# Altium schematic sheet lpc11c14.SchDoc
size A4; Organization: UNSW Solar Racing Team; Address3: UNSW; Address4: Sydney NSW 2052; Address2: Electrical Engineering; Address1: Rm 109
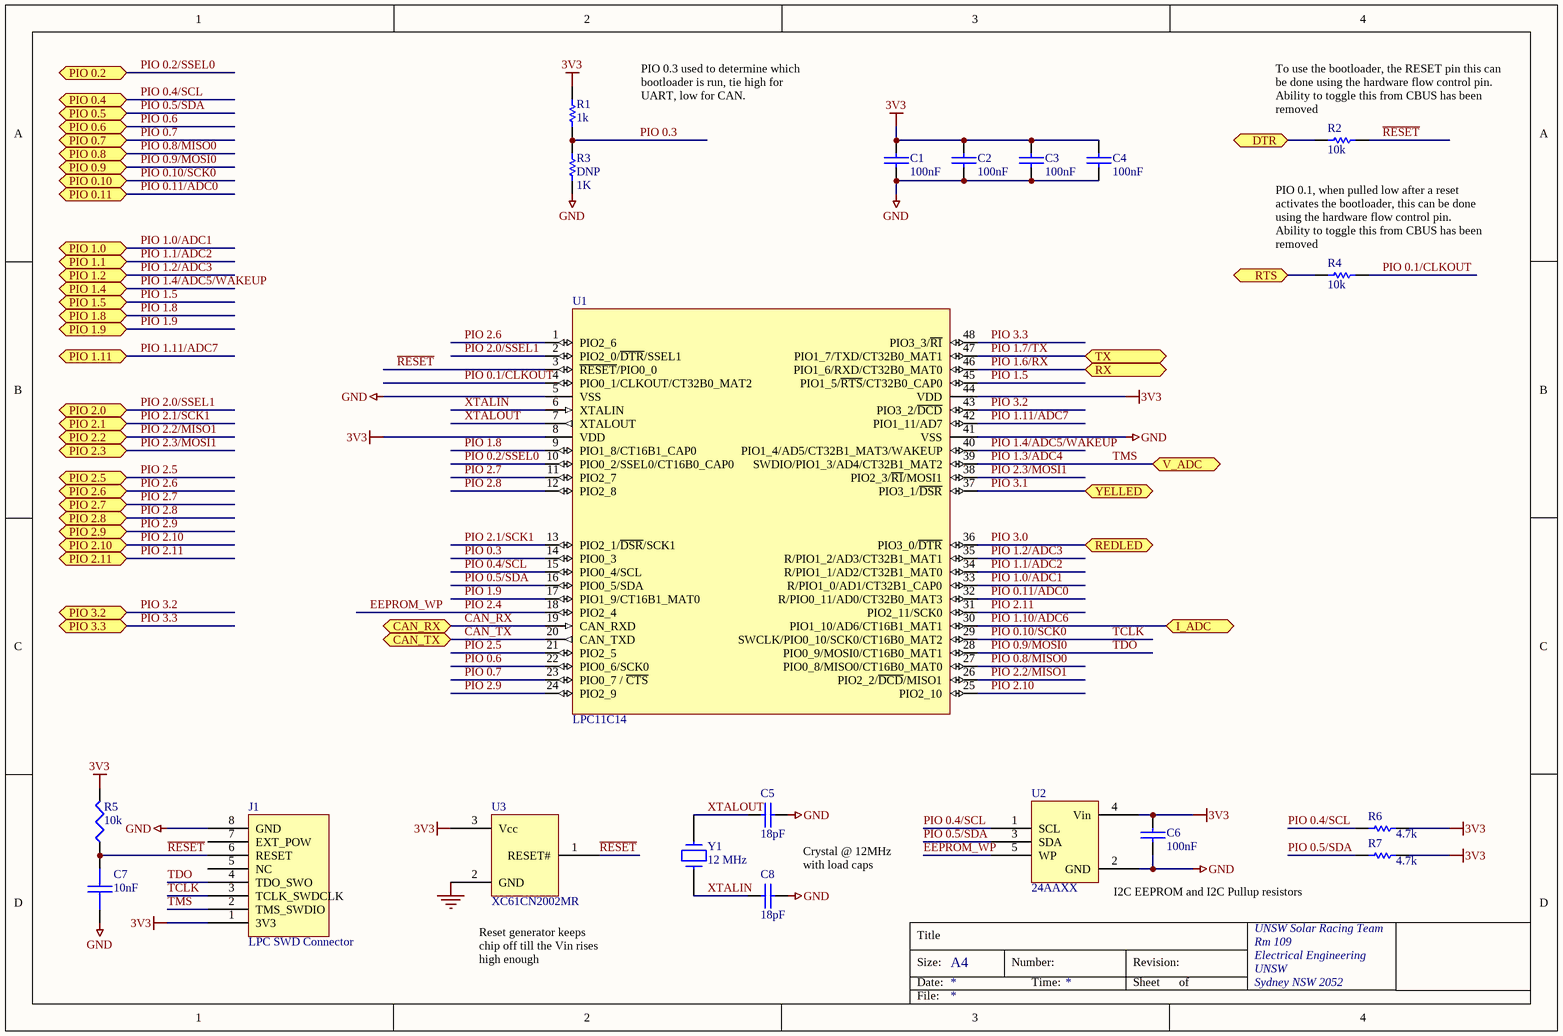
[diagram p0: lpc11c14.SchDoc]

## Parts
C1  100nF  [0603]
C2  100nF  [0603]
C3  100nF  [0603]
C4  100nF  [0603]
C5  18pF  [0603]
C6  100nF  [0603]
C7  10nF  [0603]
C8  18pF  [0603]
J1  LPC SWD Connector  [IDC8]
R1  1k  [0603]
R2  10k  [0603]
R3  DNP  value 1K  [0603]
R4  10k  [0603]
R5  10k  [0603]
R6  4.7k  [0603]
R7  4.7k  [0603]
U1  LPC11C14  [QFP48]
U2  24AAXX  [SOT23-5]
U3  XC61CN2002MR  [SOT23-3]
Y1  12 MHz  [HC49/4H]

## Ports
CAN_RX, CAN_TX, DTR, I_ADC, PIO 0.2, PIO 0.4, PIO 0.5, PIO 0.6, PIO 0.7, PIO 0.8, PIO 0.9, PIO 0.10, PIO 0.11, PIO 1.0, PIO 1.1, PIO 1.2, PIO 1.4, PIO 1.5, PIO 1.8, PIO 1.9, PIO 1.11, PIO 2.0, PIO 2.1, PIO 2.2, PIO 2.3, PIO 2.5, PIO 2.6, PIO 2.7, PIO 2.8, PIO 2.9, PIO 2.10, PIO 2.11, PIO 3.2, PIO 3.3, REDLED (bidir), RTS, RX, TX, V_ADC, YELLED (bidir)

## Nets
3V3: C1.1 C2.1 C3.1 C4.1 C6.1 J1.1(3V3) R1.2 R5.2 R6.2 R7.2 U1.8(VDD) U1.44(VDD) U2.4(Vin) U3.3(Vcc)
GND: C1.2 C2.2 C3.2 C4.2 C5.2 C6.2 C7.2 C8.2 J1.8(GND) R3.1 U1.5(VSS) U1.41(VSS) U2.2(GND) U3.2(GND)
CAN_RX: U1.19(CAN_RXD) ; port CAN_RX
CAN_TX: U1.20(CAN_TXD) ; port CAN_TX
DTR: R2.1 ; port DTR
EEPROM_WP: U1.18(PIO2_4) U2.5(WP)  [also labelled PIO 2.4]
PIO 0.1/CLKOUT: R4.2 U1.4(PIO0_1/CLKOUT/CT32B0_MAT2)
PIO 0.2/SSEL0: U1.10(PIO0_2/SSEL0/CT16B0_CAP0) ; port PIO 0.2
PIO 0.3: R1.1 R3.2 U1.14(PIO0_3)
PIO 0.4/SCL: R6.1 U1.15(PIO0_4/SCL) U2.1(SCL) ; port PIO 0.4
PIO 0.5/SDA: R7.1 U1.16(PIO0_5/SDA) U2.3(SDA) ; port PIO 0.5
PIO 0.6: U1.22(PIO0_6/SCK0) ; port PIO 0.6
PIO 0.7: U1.23(PIO0_7_/_~{CTS}) ; port PIO 0.7
PIO 0.8/MISO0: U1.27(PIO0_8/MISO0/CT16B0_MAT0) ; port PIO 0.8
PIO 0.9/MOSI0: J1.4(TDO_SWO) U1.28(PIO0_9/MOSI0/CT16B0_MAT1) ; port PIO 0.9  [also labelled TDO]
PIO 0.10/SCK0: J1.3(TCLK_SWDCLK) U1.29(SWCLK/PIO0_10/SCK0/CT16B0_MAT2) ; port PIO 0.10  [also labelled TCLK]
PIO 0.11/ADC0: U1.32(R/PIO0_11/AD0/CT32B0_MAT3) ; port PIO 0.11
PIO 1.0/ADC1: U1.33(R/PIO1_0/AD1/CT32B1_CAP0) ; port PIO 1.0
PIO 1.1/ADC2: U1.34(R/PIO1_1/AD2/CT32B1_MAT0) ; port PIO 1.1
PIO 1.2/ADC3: U1.35(R/PIO1_2/AD3/CT32B1_MAT1) ; port PIO 1.2
PIO 1.3/ADC4: J1.2(TMS_SWDIO) U1.39(SWDIO/PIO1_3/AD4/CT32B1_MAT2) ; port V_ADC  [also labelled TMS]
PIO 1.4/ADC5/WAKEUP: U1.40(PIO1_4/AD5/CT32B1_MAT3/WAKEUP) ; port PIO 1.4
PIO 1.5: U1.45(PIO1_5/~{RTS}/CT32B0_CAP0) ; port PIO 1.5
PIO 1.6/RX: U1.46(PIO1_6/RXD/CT32B0_MAT0) ; port RX
PIO 1.7/TX: U1.47(PIO1_7/TXD/CT32B0_MAT1) ; port TX
PIO 1.8: U1.9(PIO1_8/CT16B1_CAP0) ; port PIO 1.8
PIO 1.9: U1.17(PIO1_9/CT16B1_MAT0) ; port PIO 1.9
PIO 1.10/ADC6: U1.30(PIO1_10/AD6/CT16B1_MAT1) ; port I_ADC
PIO 1.11/ADC7: U1.42(PIO1_11/AD7) ; port PIO 1.11
PIO 2.0/SSEL1: U1.2(PIO2_0/~{DTR}/SSEL1) ; port PIO 2.0
PIO 2.1/SCK1: U1.13(PIO2_1/~{DSR}/SCK1) ; port PIO 2.1
PIO 2.2/MISO1: U1.26(PIO2_2/~{DCD}/MISO1) ; port PIO 2.2
PIO 2.3/MOSI1: U1.38(PIO2_3/~{RI}/MOSI1) ; port PIO 2.3
PIO 2.5: U1.21(PIO2_5) ; port PIO 2.5
PIO 2.6: U1.1(PIO2_6) ; port PIO 2.6
PIO 2.7: U1.11(PIO2_7) ; port PIO 2.7
PIO 2.8: U1.12(PIO2_8) ; port PIO 2.8
PIO 2.9: U1.24(PIO2_9) ; port PIO 2.9
PIO 2.10: U1.25(PIO2_10) ; port PIO 2.10
PIO 2.11: U1.31(PIO2_11/SCK0) ; port PIO 2.11
PIO 3.0: U1.36(PIO3_0/~{DTR}) ; port REDLED
PIO 3.1: U1.37(PIO3_1/~{DSR}) ; port YELLED
PIO 3.2: U1.43(PIO3_2/~{DCD}) ; port PIO 3.2
PIO 3.3: U1.48(PIO3_3/~{RI}) ; port PIO 3.3
~{RESET}: C7.1 J1.6(RESET) R2.2 R5.1 U1.3(~{RESET}/PIO0_0) U3.1(RESET#)
RTS: R4.1 ; port RTS
XTALIN: C8.1 U1.6(XTALIN) Y1.1
XTALOUT: C5.1 U1.7(XTALOUT) Y1.2

Not connected (* = marked no-connect by the designer): J1 5(NC) 7(EXT_POW)

## Notes on the sheet
- PIO 0.3 used to determine which bootloader is run, tie high for UART, low for CAN.
- (near R2) To use the bootloader, the RESET pin this can be done using the hardware flow control pin.
  Ability to toggle this from CBUS has been removed
- (near C2) Text
- PIO 0.1, when pulled low after a reset activates the bootloader, this can be done using the hardware flow control pin.
  Ability to toggle this from CBUS has been removed
- Crystal @ 12MHz with load caps
- (near U2) I2C EEPROM and I2C Pullup resistors
- (near U3) Reset generator keeps chip off till the Vin rises high enough
- Title
- Size:
- Date:
- A4
- Number:
- Time:
- Revision:
- Sheet
- of
- File:

## Library data of the parts
C1-C4 C6 C7 = CAP: Capacitor; Needed?: NO - HW LAB
  C1-C4 C6: Value: 100nF
  C7: Value: 10nF
C5 C8 = CAP: Capacitor; Manufacturer: Kemet; Manufacturer Part Number: CBR06C180FAGAC; Needed?: Farnell; Description: CAP CER 18PF 250V 1% NP0 0603; Voltage - Rated: 250V; Tolerance: ±1%; Temperature Coefficient: C0G, NP0; Value: 18pF; Farnell: 1844169; Farnell Price: 0.025; Supplier 1: Digi-Key; Supplier Part Number 1: 399-8842-1-ND; RoHS: RoHS Compliant; Category: Capacitors; Stock 1: 1121; Pricing 1: 1=0.85, 10=0.811, 50=0.4846, 100=0.3937, 250=0.32708, 500=0.2968, 1000=0.27257 (AUD); Packaging: Cut Tape (CT); Capacitance: 18pF; Mounting Type: Surface Mount, MLCC; Operating Temperature: -55°C ~ 125°C; Applications: RF, Microwave, High Frequency; Ratings: -; Package / Case: 0603 (1608 Metric); Size / Dimension: 0.063" L x 0.031" W (1.60mm x 0.80mm); Height - Seated (Max): -; Thickness (Max): 0.034" (0.87mm); Lead Spacing: -; Features: High Q, Low Loss; Lead Style: -; ComponentLink1URL: http://www.kemet.com/kemet/web/homepage/kechome.nsf/file/E8E10945B57BE93285257989006DD493/$file/KEM_C1030_CBR_SMD.pdf; ComponentLink1Description: http://www.kemet.com/kemet/web/homepage/kechome.nsf/file/E8E10945B57BE93285257989006DD493/$file/KEM_C1030_CBR_SMD.pdf
J1 = LPCLink_Connector: Needed?: NO - Common
R1-R4 R6 R7 = Res Semi: Semiconductor Resistor; Published: 8-Jun-2000; LatestRevisionDate: 17-Jul-2002; LatestRevisionNote: Re-released for DXP Platform.; PackageReference: AXIAL-0.5; Publisher: Altium Limited; PackageDescription: Axial Device, Thru-Hole; 2 Leads; 0.5 in Pin Spacing
  R1: Value: 1K
  R2 R4: Value: 10k
  R6 R7: Value: 4.7k
R5 = RES1: Resistor; Needed?: NO - HW LAB; Value: 10k
U1 = LPC11C14_Full: NXP LPC11C14 Microcontroller; Farnell: NA
U2 = 24AAXX: I2C EEPROM for SOT23-5 package
U3 = XC61F: SOT23 reset generator; Needed?: Farnell; Farnell: 3605486; Farnell Price: 1.74
Y1 = CRYSTAL: Needed?: RS; RS: 693-8803; RS Price: 0.95